# Altium schematic sheet Ethernet1.SchDoc: ETHERNET 1
size A3; Date: Not used; ApprovedBy: Not used; CheckedBy: Not used; Author: Not used; CompanyName: STMicroelectronics; DrawnBy: Not used; Engineer: Not used; Organization: Not used; Address1: Not used; Address2: Not used; Address3: Not used; Address4: Not used; DocumentNumber: Not used; Revision: Not used; SheetNumber: 7; SheetTotal: 18; CurrentTime: Not used; CurrentDate: Not used; Time: Not used; DocumentFullPathAndName: Not used; DocumentName: Not used; ModifiedDate: Not used; ImagePath: Not used; ProjectName: Not used; Application_BuildNumber: Not used
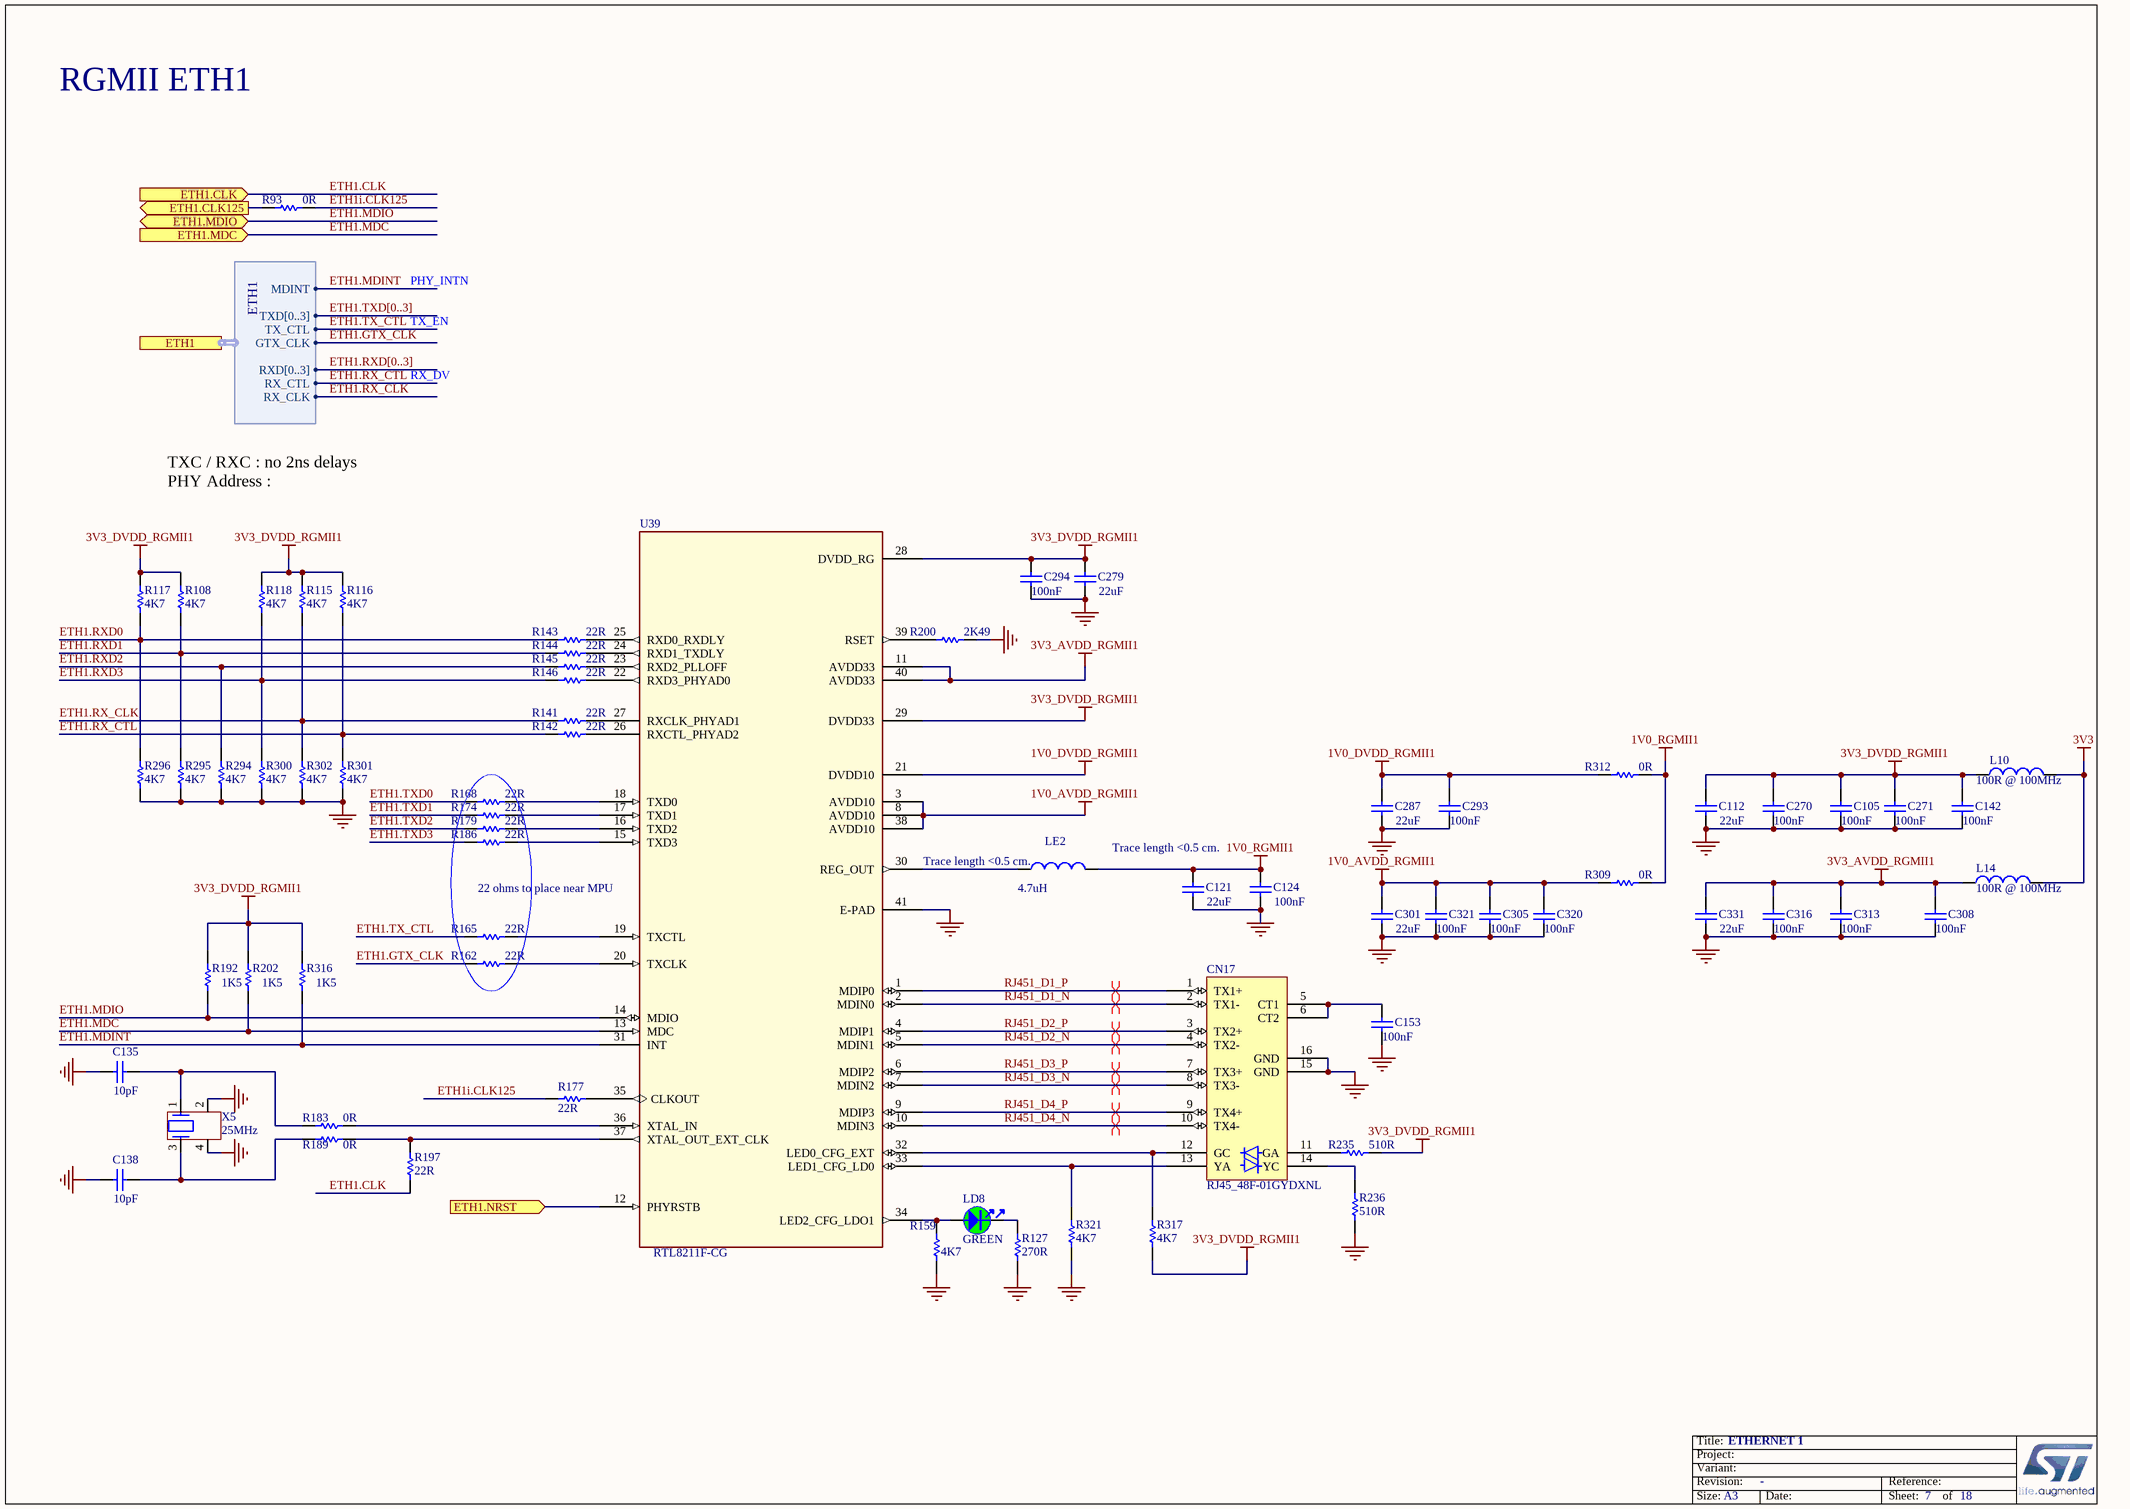
[diagram p0: Ethernet1.SchDoc]

## Parts
C105  value 100nF  [C0402]
C112  value 22uF  [C0603]
C121  value 22uF  [C0603]
C124  value 100nF  [C0402]
C135  value 10pF  [C0402]
C138  value 10pF  [C0402]
C142  value 100nF  [C0402]
C153  value 100nF  [C0402]
C270  value 100nF  [C0402]
C271  value 100nF  [C0402]
C279  value 22uF  [C0603]
C287  value 22uF  [C0603]
C293  value 100nF  [C0402]
C294  value 100nF  [C0402]
C301  value 22uF  [C0603]
C305  value 100nF  [C0402]
C308  value 100nF  [C0402]
C313  value 100nF  [C0402]
C316  value 100nF  [C0402]
C320  value 100nF  [C0402]
C321  value 100nF  [C0402]
C331  value 22uF  [C0603]
CN17  value RJ45_48F-01GYDXNL  [CON_RJ45_YD_48F-01GYDXNL_LED-P]  (hidden comment: ​New part for use of led pulled down on pin 13/14 , schematic more lisible.)
L10  value 100R @ 100MHz  [FIL_0603_H0P65]
L14  value 100R @ 100MHz  [FIL_0603_H0P65]
LD8  value GREEN  [LED_0603_OSRAM_LG-Q396-PS-35_GREEN_1A2K_H0P4]  (hidden comment: LED_green)
LE2  value 4.7uH  [L1210_LQH]
R93  value 0R  [R0402]
R108  value 4K7  [R0402]
R115  value 4K7  [R0402]
R116  value 4K7  [R0402]
R117  value 4K7  [R0402]
R118  value 4K7  [R0402]
R127  value 270R  [R0402]  (hidden comment: Resistor)
R141  value 22R  [R0201_H0P23]  (hidden comment: Resistor)
R142  value 22R  [R0201_H0P23]  (hidden comment: Resistor)
R143  value 22R  [R0201_H0P23]  (hidden comment: Resistor)
R144  value 22R  [R0201_H0P23]  (hidden comment: Resistor)
R145  value 22R  [R0201_H0P23]  (hidden comment: Resistor)
R146  value 22R  [R0201_H0P23]  (hidden comment: Resistor)
R159  value 4K7  [R0402]
R162  value 22R  [R0201_H0P23]  (hidden comment: Resistor)
R165  value 22R  [R0201_H0P23]  (hidden comment: Resistor)
R168  value 22R  [R0201_H0P23]  (hidden comment: Resistor)
R174  value 22R  [R0201_H0P23]  (hidden comment: Resistor)
R177  value 22R  [R0201_H0P23]  (hidden comment: Resistor)
R179  value 22R  [R0201_H0P23]  (hidden comment: Resistor)
R183  value 0R  [R0402]
R186  value 22R  [R0201_H0P23]  (hidden comment: Resistor)
R189  value 0R  [R0402]
R192  value 1K5  [R0402]
R197  value 22R  [R0201_H0P23]  (hidden comment: Resistor)
R200  value 2K49  [R0402]
R202  value 1K5  [R0402]
R235  value 510R  [R0402]
R236  value 510R  [R0402]
R294  value 4K7  [R0402]
R295  value 4K7  [R0402]
R296  value 4K7  [R0402]
R300  value 4K7  [R0402]
R301  value 4K7  [R0402]
R302  value 4K7  [R0402]
R309  value 0R  [R0603]
R312  value 0R  [R0603]
R316  value 1K5  [R0402]
R317  value 4K7  [R0402]
R321  value 4K7  [R0402]
U39  RTL8211F-CG  [ICC_QFN40-EPAD_5X5_P040]
X5  value 25MHz  [CRY_NX3225HA_4P]  (hidden comment: XTAL_4_PINS)

## Ports
ETH1 (harness ETH1), ETH1.CLK125 (out), ETH1.CLK (in), ETH1.MDC (in), ETH1.MDIO (bidir), ETH1.NRST (in)

## Harnesses
ETH1: MDINT, TXD[0..3], RX_CLK, GTX_CLK, TX_CTL, RXD[0..3], RX_CTL

## Nets
1V0_AVDD_RGMII1: C301.2 C305.2 C320.2 C321.2 R309.1 U39.3(AVDD10) U39.8(AVDD10) U39.38(AVDD10)
1V0_DVDD_RGMII1: C287.2 C293.2 R312.1 U39.21(DVDD10)
1V0_RGMII1: C121.2 C124.2 LE2.2 R309.2 R312.2
3V3: L10.2 L14.2
3V3_AVDD_RGMII1: C308.2 C313.2 C316.2 C331.2 L14.1 U39.11(AVDD33) U39.40(AVDD33)
3V3_DVDD_RGMII1: C105.2 C112.2 C142.2 C270.2 C271.2 C279.1 C294.2 L10.1 R108.2 R115.2 R116.2 R117.2 R118.2 R192.2 R202.2 R235.2 R316.2 R317.1 U39.28(DVDD_RG) U39.29(DVDD33)
GND: C105.1 C112.1 C121.1 C124.1 C135.1 C138.1 C142.1 C153.1 C270.1 C271.1 C279.2 C287.1 C293.1 C294.1 C301.1 C305.1 C308.1 C313.1 C316.1 C320.1 C321.1 C331.1 CN17.15(GND) CN17.16(GND) R127.2 R159.1 R200.2 R236.1 R294.1 R295.1 R296.1 R300.1 R301.1 R302.1 R321.1 U39.41(E-PAD) X5.2 X5.4
ETH1.CLK: R197.1 ; port ETH1.CLK
ETH1.CLK125: R93.1 ; port ETH1.CLK125
ETH1.GTX_CLK: R162.1 ; port ETH1.GTX_CLK
ETH1.MDC: R202.1 U39.13(MDC) ; port ETH1.MDC
ETH1.MDINT: R316.1 U39.31(INT) ; port ETH1.MDINT
ETH1.MDIO: R192.1 U39.14(MDIO) ; port ETH1.MDIO
ETH1.NRST: U39.12(PHYRSTB) ; port ETH1.NRST
ETH1.RX_CLK: R115.1 R141.1 R302.2 ; port ETH1.RX_CLK
ETH1.RX_CTL: R116.1 R142.1 R301.2 ; port ETH1.RX_CTL
ETH1.RXD0: R117.1 R143.1 R296.2
ETH1.RXD1: R108.1 R144.1 R295.2
ETH1.RXD2: R145.1 R294.2
ETH1.RXD3: R118.1 R146.1 R300.2
ETH1.TX_CTL: R165.1 ; port ETH1.TX_CTL
ETH1.TXD0: R168.1
ETH1.TXD1: R174.1
ETH1.TXD2: R179.1
ETH1.TXD3: R186.1
ETH1i.CLK125: R93.2 R177.1
RJ451_D1_N: CN17.2(TX1-) U39.2(MDIN0)
RJ451_D1_P: CN17.1(TX1+) U39.1(MDIP0)
RJ451_D2_N: CN17.4(TX2-) U39.5(MDIN1)
RJ451_D2_P: CN17.3(TX2+) U39.4(MDIP1)
RJ451_D3_N: CN17.8(TX3-) U39.7(MDIN2)
RJ451_D3_P: CN17.7(TX3+) U39.6(MDIP2)
RJ451_D4_N: CN17.10(TX4-) U39.10(MDIN3)
RJ451_D4_P: CN17.9(TX4+) U39.9(MDIP3)
NetC135_2: C135.2 R183.1 X5.1
NetC138_2: C138.2 R189.1 X5.3
NetC153_2: C153.2 CN17.5(CT1) CN17.6(CT2)
NetCN17_11: CN17.11(GA) R235.1
NetCN17_12: CN17.12(GC) R317.2 U39.32(LED0_CFG_EXT)
NetCN17_13: CN17.13(YA) R321.2 U39.33(LED1_CFG_LD0)
NetCN17_14: CN17.14(YC) R236.2
NetLD8_1: LD8.1 R159.2 U39.34(LED2_CFG_LDO1)
NetLD8_2: LD8.2 R127.1
NetLE2_1: LE2.1 U39.30(REG_OUT)
NetR141_2: R141.2 U39.27(RXCLK_PHYAD1)
NetR142_2: R142.2 U39.26(RXCTL_PHYAD2)
NetR143_2: R143.2 U39.25(RXD0_RXDLY)
NetR144_2: R144.2 U39.24(RXD1_TXDLY)
NetR145_2: R145.2 U39.23(RXD2_PLLOFF)
NetR146_2: R146.2 U39.22(RXD3_PHYAD0)
NetR162_2: R162.2 U39.20(TXCLK)
NetR165_2: R165.2 U39.19(TXCTL)
NetR168_2: R168.2 U39.18(TXD0)
NetR174_2: R174.2 U39.17(TXD1)
NetR177_2: R177.2 U39.35(CLKOUT)
NetR179_2: R179.2 U39.16(TXD2)
NetR183_2: R183.2 U39.36(XTAL_IN)
NetR186_2: R186.2 U39.15(TXD3)
NetR189_2: R189.2 R197.2 U39.37(XTAL_OUT_EXT_CLK)
NetR200_1: R200.1 U39.39(RSET)

## Buses and harness runs
bus ETH1.RXD[0..3]
bus ETH1.TXD[0..3]

## Layout directives
differential pair: RJ451_D1_N, RJ451_D1_P, RJ451_D2_N, RJ451_D2_P, RJ451_D3_N, RJ451_D3_P, RJ451_D4_N, RJ451_D4_P

## Notes on the sheet
- RGMII ETH1
- PHY_INTN
- RX_DV
- TX_EN
- TXC / RXC : no 2ns delays
  PHY Address :
  AD[2:0] : 100 (0x04) default
- Trace length <0.5 cm.
- (near U39) 22 ohms to place near MPU
- (near LE2) Trace length <0.5 cm.
- Title:
- Project:
- Size:
- Revision:
- Variant:
- A3
- -
- Date:
- Reference:
- Sheet:
- of

## Library data of the parts
C105 C124 C142 C153 C270 C271 C293 C294 C305 C308 C313 C316 C320 C321 = MCD-00006: Capacitor,100nF,16V,X7R,10%,0402; Manufacturer_Part_Number: CC0402KRX7R7BB104; Manufacturer: YAGEO; Alternate_Manufacturer: MURATA; Alternate_Manufacturer_Part_Number: GCM155R71C104KA55D; Part_Preference: Recommended; Provided_By: SUBCO; Initial_Board_Reference: mb1274; Order_Code_RS: 616-9701; Component_Country_Of_Origin: China; ID: 2474; ShowFields: YES; Internal_Part_Number: MCD-00006; ComponentLink1Description: Datasheet; ECCN_US: n/a; ECCN_EU: n/a; Status: Released; Part_Type: Capacitor; Package: 0402; ComponentLink1URL: http://tunmcdsvn.tun.st.com/Component_Documentation_Library/Trunk/Capacitor/YAGEO_X7R_Series; Order_Code_Digikey: 311-1338-1-ND; Order_Code_Farnell: 9402047
C112 C121 C279 C287 C301 C331 = MCD-00100: Capacitor,22uF,6V3,X5R,20%,0603; Manufacturer_Part_Number: GRM188R60J226MEA0J; Manufacturer: MURATA; Part_Preference: Recommended; ECCN_US: EAR99; ECCN_EU: NEC; Provided_By: SUBCO; Initial_Board_Reference: mb1262; Component_Country_Of_Origin: Japan; ID: 2766; ShowFields: YES; Internal_Part_Number: MCD-00100; ComponentLink1Description: Datasheet; Status: Released; Part_Type: Capacitor; Package: 0603; ComponentLink1URL: http://tunmcdsvn.tun.st.com/Component_Documentation_Library/Trunk/Capacitor/MURATA_GRM_Series; Order_Code_Digikey: 490-7612-2-ND; Order_Code_Farnell: N/A; Order_Code_RS: N/A
C135 C138 = MCD-00015: Capacitor,10pF,50V,NPO,5%,0402; Manufacturer_Part_Number: CC0402JRNPO9BN100; Manufacturer: YAGEO; Part_Preference: Recommended; Provided_By: SUBCO; Initial_Board_Reference: mb1274; Order_Code_RS: 616-9256; Component_Country_Of_Origin: China; ID: 2465; ShowFields: YES; Internal_Part_Number: MCD-00015; ComponentLink1Description: Datasheet; ECCN_US: n/a; ECCN_EU: n/a; Status: Released; Part_Type: Capacitor; Package: 0402; ComponentLink1URL: http://tunmcdsvn.tun.st.com/Component_Documentation_Library/Trunk/Capacitor/YAGEO_NP0_Series; Order_Code_Digikey: 311-1014-1-ND; Order_Code_Farnell: 3019160RL
CN17 = MCD-01129: Connector_RJ45, led pull down, T= 13.84mm; Manufacturer_Part_Number: 48F-01GYDXNL; Manufacturer: YUAN DEAN SCIENTIFIC; Part_Preference: Recommended; Component_Country_Of_Origin: Unknown; ID: 3367; ShowFields: YES; Internal_Part_Number: MCD-01129; Status: New; Part_Type: Connector; ComponentLink1URL: http://tunmcdsvn.tun.st.com/Component_Documentation_Library/Trunk/Connector/YUAN_DEAN_SCIENTIFIC_48F_Series/; Order_Code_Digikey: N/A; Order_Code_Farnell: N/A; Order_Code_RS: N/A
L10 L14 = MCD-00094: Ferrite bead 100R 2A 0603; Manufacturer_Part_Number: BLM18EG101TN1; Manufacturer: MURATA; Part_Type: Inductor; Part_Preference: Recommended; ECCN_US: EAR99; ECCN_EU: NEC; Provided_By: SUBCO; Initial_Board_Reference: mb1262; Order_Code_RS: 792-6246; Component_Country_Of_Origin: Japan; ID: 2774; ShowFields: YES; Internal_Part_Number: MCD-00094; ComponentLink1Description: Datasheet; Status: Released; ComponentLink1URL: http://tunmcdsvn.tun.st.com/Component_Documentation_Library/Trunk/Inductor/MURATA_BLM_Series; Order_Code_Digikey: 490-5978-2-ND; Order_Code_Farnell: 1515714; Package: 0603
LD8 = MCD-00588: LED Green, 0603 SMD, Forward Voltage Typ=2V, Max=2.5V; Part_Type: Display; Manufacturer_Part_Number: LG Q396-PS-35; Manufacturer: OSRAM OPTO SEMICONDUCTORS; Alternate_Manufacturer_Part_Number: VLMTG1300-GS08; Alternate_Manufacturer: VISHAY SEMICONDUCTOR OPTO DIVISION; Alternate_Internal_Part_Number: MCD-02400; Part_Preference: Recommended; Provided_By: SUBCO; Component_Country_Of_Origin: Unknown; ID: 3155; ShowFields: YES; Internal_Part_Number: MCD-00588; Status: Released; Package: LED 0603; ComponentLink1Description: Datasheet; ComponentLink1URL: http://tunmcdsvn.tun.st.com/Component_Datasheet_Library/Trunk/Display/OSRAM_LED_GREEN_LG Q396-PS-35; Order_Code_Digikey: LG Q396-PS-35-ND; ECCN_US: n/a; ECCN_EU: n/a
LE2 = MCD-00048: FIXED IND 4.7UH 1A 180 MOHM 30% SMD; Manufacturer_Part_Number: LQH32PN4R7NN0L; Manufacturer: MURATA; Part_Preference: Recommended; Provided_By: SUBCO; Initial_Board_Reference: mb1274; Order_Code_RS: 167-4086; Component_Country_Of_Origin: Japan; ID: 2544; ShowFields: YES; Internal_Part_Number: MCD-00048; ComponentLink1Description: Datasheet; ECCN_US: n/a; ECCN_EU: n/a; Status: Released; Part_Type: Inductor; ComponentLink1URL: http://tunmcdsvn.tun.st.com/Component_Documentation_Library/Trunk/Inductor/MURATA_LQH32PN4R7NN0; Order_Code_Digikey: 490-5338-2-ND; Order_Code_Farnell: 2470296; Package: 1210
R93 R183 R189 = MCD-00052: Resistor,0R,0402,5%,1/16W; Manufacturer_Part_Number: RC0402JR-070RL; Manufacturer: YAGEO; Part_Preference: Recommended; Provided_By: SUBCO; Initial_Board_Reference: mb1274; Order_Code_RS: 618-5804; Component_Country_Of_Origin: China; ID: 2540; ShowFields: YES; Internal_Part_Number: MCD-00052; ComponentLink1Description: Datasheet; ECCN_US: n/a; ECCN_EU: n/a; Status: Released; Part_Type: Resistor; ComponentLink1URL: http://tunmcdsvn.tun.st.com/Component_Documentation_Library/Trunk/Resistor/YAGEO_RC_L_Series; Package: 0402; Order_Code_Digikey: 311-0.0JRCT-ND; Order_Code_Farnell: 9232516RL
R108 R115-R118 R294-R296 R300-R302 = MCD-00065: Resistor,4K7,0402,1%,1/16W; Manufacturer_Part_Number: RC0402FR-074K7L; Manufacturer: YAGEO; Alternate_Manufacturer_Part_Number: RT0402FRE074K7L; Provided_By: SUBCO; Initial_Board_Reference: mb1274; Internal_Part_Number: MCD-00065; Alternate_Manufacturer: YAGEO; ComponentLink1Description: Datasheet; ECCN_US: n/a; ECCN_EU: n/a; Status: Released; Part_Type: Resistor; ComponentLink1URL: http://tunmcdsvn.tun.st.com/Component_Datasheet_Library/Trunk/Resistors/Yageo_Resistor_RC0402-series; Package: R0402
R127 = MCD-00441: Resistor,270R,0402,1%,1/16W; Manufacturer_Part_Number: RC0402FR-07270RL; Manufacturer: YAGEO; Part_Preference: Recommended; Provided_By: SUBCO; ECCN_US: EAR99; ECCN_EU: NEC; Component_Country_Of_Origin: China; ID: 2838; ShowFields: YES; Internal_Part_Number: MCD-00441; Status: Released; Part_Type: Resistor; Package: 0402; ComponentLink1Description: Datasheet; ComponentLink1URL: http://tunmcdsvn.tun.st.com/Component_Documentation_Library/Trunk/Resistor/YAGEO_RC_L_Series; Order_Code_Digikey: 311-270LRCT-ND; Order_Code_Farnell: 9239162; Order_Code_RS: N/A
R141-R146 R162 R165 R168 R174 R177 R179 R186 R197 = MCD-02978: Resistor, 22R, 0201, +/-1%, 1/20W; Manufacturer_Part_Number: RC0201FR-0722RL; Manufacturer: YAGEO; Part_Preference: Recommended; Order_Code_RS: 198-7593; ID: 5094; ShowFields: YES; Internal_Part_Number: MCD-02978; Status: New; Part_Type: Resistor; ComponentLink1URL: http://tunmcdsvn.tun.st.com/Component_Documentation_Library/Trunk/Resistor/YAGEO_RC_L_Series; Package: 0201; Order_Code_Digikey: YAG2518TR-ND; Order_Code_Farnell: 2693564
R159 R317 R321 = MCD-00065: Resistor,4K7,0402,1%,1/16W; Manufacturer_Part_Number: RC0402FR-074K7L; Manufacturer: YAGEO; Alternate_Manufacturer_Part_Number: RT0402FRE074K7L; Part_Preference: Recommended; Provided_By: SUBCO; Initial_Board_Reference: mb1274; Component_Country_Of_Origin: China; ID: 2526; ShowFields: YES; Internal_Part_Number: MCD-00065; Alternate_Manufacturer: YAGEO; ComponentLink1Description: Datasheet; ECCN_US: n/a; ECCN_EU: n/a; Status: Released; Part_Type: Resistor; ComponentLink1URL: http://tunmcdsvn.tun.st.com/Component_Documentation_Library/Trunk/Resistor/YAGEO_RC_L_Series; Package: 0402; Order_Code_Digikey: 311-4.7KLRCT-ND; Order_Code_Farnell: 9239316; Order_Code_RS: N/A
R192 R202 R316 = MCD-00068: Resistor,1K5,0402,1%,1/16W; Manufacturer_Part_Number: RC0402FR-071K5L; Manufacturer: YAGEO; Part_Preference: Recommended; Provided_By: SUBCO; Initial_Board_Reference: mb1274; Component_Country_Of_Origin: China; ID: 2524; ShowFields: YES; Internal_Part_Number: MCD-00068; ComponentLink1Description: Datasheet; ECCN_US: n/a; ECCN_EU: n/a; Status: Released; Part_Type: Resistor; ComponentLink1URL: http://tunmcdsvn.tun.st.com/Component_Documentation_Library/Trunk/Resistor/YAGEO_RC_L_Series; Package: 0402; Order_Code_Digikey: 311-1.50KLRCT-ND; Order_Code_Farnell: 9239251; Order_Code_RS: N/A
R200 = MCD-00183: Resistor,2K49,0402,1%,1/16W; Manufacturer_Part_Number: RC0402FR-072K49L; Manufacturer: YAGEO; Part_Preference: Recommended; Provided_By: SUBCO; Component_Country_Of_Origin: China; ID: 2687; ShowFields: YES; Internal_Part_Number: MCD-00183; ComponentLink1Description: Datasheet; ECCN_US: n/a; ECCN_EU: n/a; Status: Released; Part_Type: Resistor; ComponentLink1URL: http://tunmcdsvn.tun.st.com/Component_Documentation_Library/Trunk/Resistor/YAGEO_RC_L_Series; Package: 0402; Order_Code_Digikey: 311-2.49KLRCT-ND; Order_Code_Farnell: 1799190; Order_Code_RS: N/A
R235 R236 = MCD-00064: Resistor,510R,0402,1%,1/16W; Manufacturer_Part_Number: RC0402FR-07510RL; Manufacturer: YAGEO; Part_Preference: Recommended; Provided_By: SUBCO; Initial_Board_Reference: mb1274; Component_Country_Of_Origin: China; ID: 2525; ShowFields: YES; Internal_Part_Number: MCD-00064; ComponentLink1Description: Datasheet; ECCN_US: n/a; ECCN_EU: n/a; Status: Released; Part_Type: Resistor; ComponentLink1URL: http://tunmcdsvn.tun.st.com/Component_Documentation_Library/Trunk/Resistor/YAGEO_RC_L_Series; Package: 0402; Order_Code_Digikey: 311-510LRCT-ND; Order_Code_Farnell: 1458804; Order_Code_RS: N/A
R309 R312 = MCD-00056: Resistor,0R,0603,5%,1/10W; Manufacturer_Part_Number: RC0603JR-070RL; Manufacturer: YAGEO; Part_Preference: Recommended; Provided_By: SUBCO; Initial_Board_Reference: mb1274; Component_Country_Of_Origin: China; ID: 2536; ShowFields: YES; Internal_Part_Number: MCD-00056; ComponentLink1Description: Datasheet; ECCN_US: n/a; ECCN_EU: n/a; Status: Released; Part_Type: Resistor; ComponentLink1URL: http://tunmcdsvn.tun.st.com/Component_Documentation_Library/Trunk/Resistor/YAGEO_RC_L_Series; Package: 0603; Order_Code_Digikey: 311-0.0GRCT-ND; Order_Code_Farnell: 9233130RL; Order_Code_RS: N/A
U39 = MCD-01130: 10/100/1000M GIGABIT Ethernet Transceiver, QFN40 , SMPS version; Manufacturer: REALTEK; Part_Type: IC; Part_Preference: Recommended; Provided_By: SUBCO; Initial_Board_Reference: MB1272; Component_Country_Of_Origin: Unknown; ID: 3370; ShowFields: YES; Value: RTL8211F-CG; Internal_Part_Number: MCD-01130; Manufacturer_Part_Number: RTL8211F-CG; ComponentLink1Description: Datasheet; ComponentLink1URL: http://tunmcdsvn.tun.st.com/Component_Datasheet_Library/Trunk/IC/REALTEK_RTL8211F_RGMII_phy; Status: Checked; ECCN_US: n/a; ECCN_EU: n/a
X5 = MCD-01463: Crystal 25Mhz, 10pF, -+50PPM, SMD; Part_Type: Crystal_Osc; Manufacturer_Part_Number: NX3225GA-25MHZ-EXS00A-CG06750; Manufacturer: NDK; BMS_Part_Number: 9157035; Part_Preference: Recommended; Provided_By: SUBCO; Initial_Board_Reference: MB1272B; Remark: footprint same as CRY_NX3225HA_4P; Component_Country_Of_Origin: Unknown; ID: 3563; ShowFields: YES; Internal_Part_Number: MCD-01463; Status: Checked; Package: 3.2x2.5mm; ComponentLink1Description: Datasheet; ComponentLink1URL: http://tunmcdsvn.tun.st.com/Component_Documentation_Library/Trunk/Crytal_Oscillator/NDK_NX3225GA_Series; Order_Code_Digikey: 644-1390; Order_Code_Farnell: N/A; Order_Code_RS: N/A